# Altium project MotorDriver.PrjPcb
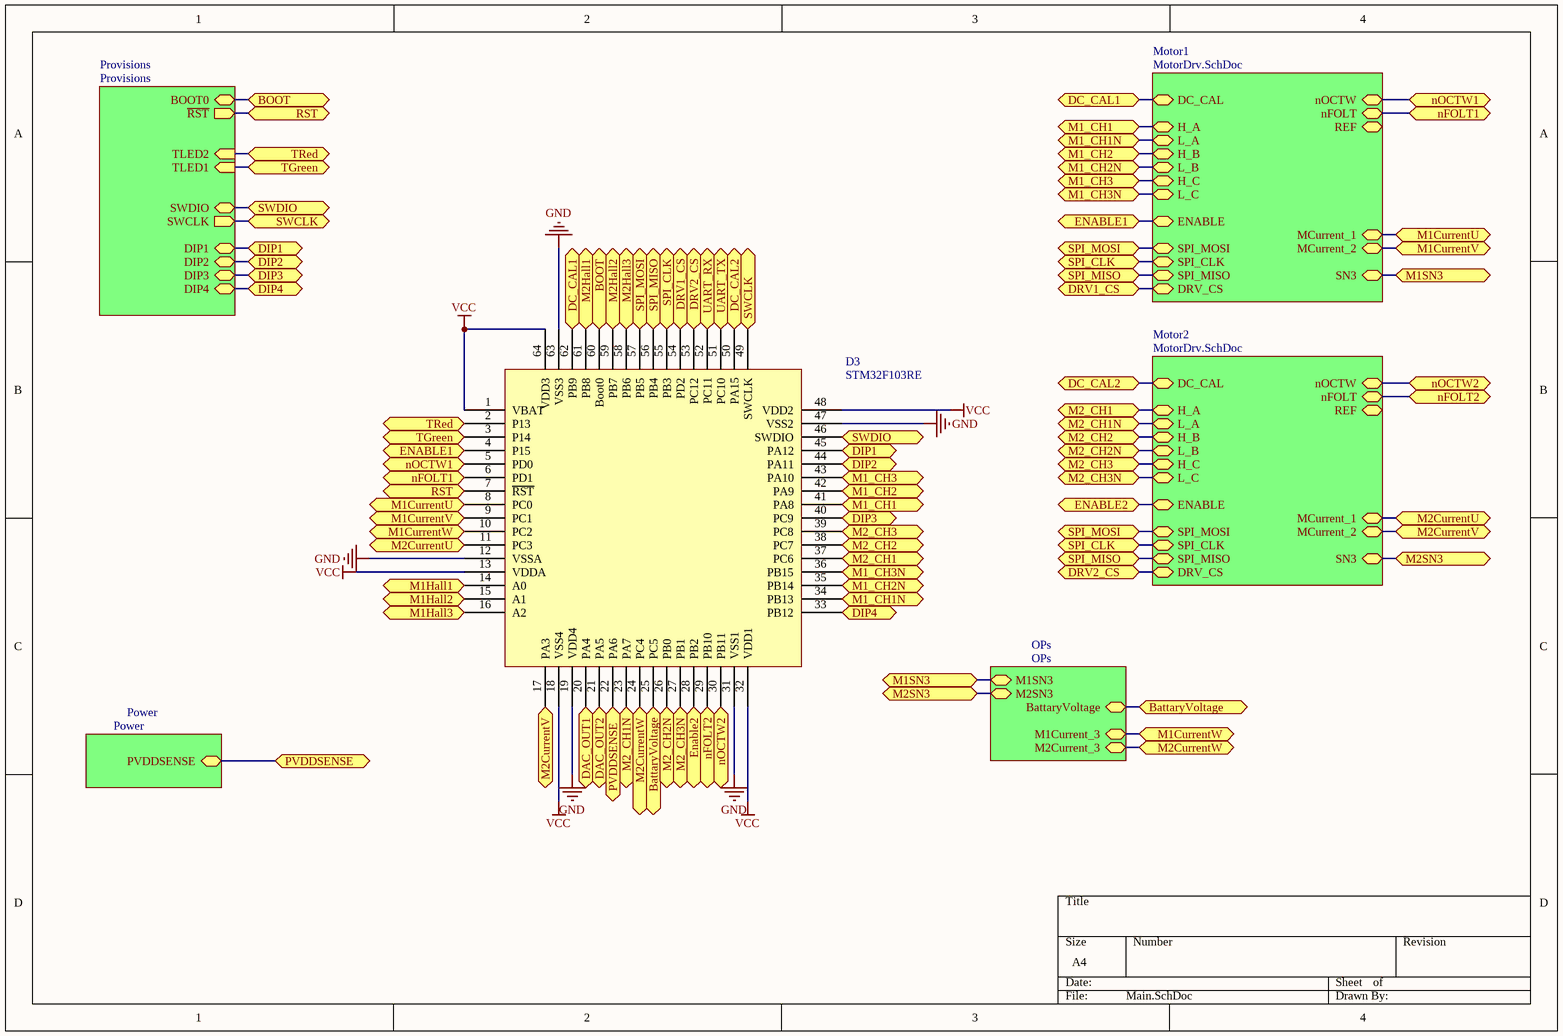
[diagram p0: Main.SchDoc]
8 sheets, 168 parts. Net scope: hierarchical (ports join the sheet entries above them; power ports are global).
Board file: Motor1.PcbDoc
Sheets:
  Main.SchDoc
    Motor1 = MotorDrv.SchDoc
      Driver = Drv8301.SchDoc
      MOSFETs = MOSFETs.SchDoc
        Channel_A = Bridge.SchDoc
        Channel_B = Bridge.SchDoc
        Channel_C = Bridge.SchDoc
    Power = Power.SchDoc
    Motor2 = MotorDrv.SchDoc
      Driver = Drv8301.SchDoc
      MOSFETs = MOSFETs.SchDoc
        Channel_A = Bridge.SchDoc
        Channel_B = Bridge.SchDoc
        Channel_C = Bridge.SchDoc
    OPs = OPs.SchDoc
    Provisions = Provisions.SchDoc

## Sheet Main.SchDoc
size A4

### Parts
D3  STM32F103RE  [LQFP64_N]

### Sub-sheets
Motor1 = MotorDrv.SchDoc: DRV_CS, H_A, H_C, DC_CAL, L_A, H_B, ENABLE, SPI_MOSI, SPI_CLK, nOCTW, REF, nFOLT, L_B, L_C, SPI_MISO, MCurrent_1, MCurrent_2, SN3
Motor2 = MotorDrv.SchDoc: DRV_CS, H_A, H_C, DC_CAL, L_A, H_B, ENABLE, SPI_MOSI, SPI_CLK, nOCTW, REF, nFOLT, L_B, L_C, SPI_MISO, MCurrent_1, MCurrent_2, SN3
OPs = OPs: BattaryVoltage, M2SN3, M2Current_3, M1SN3, M1Current_3
Power = Power: PVDDSENSE
Provisions = Provisions: BOOT0, SWCLK (out), TLED2 (in), TLED1 (in), SWDIO, ~{RST} (out), DIP3, DIP4, DIP2, DIP1

### Ports
BattaryVoltage, BOOT, DAC_OUT1, DAC_OUT2, DC_CAL1, DC_CAL2, DIP1, DIP2, DIP3, DIP4, DRV1_CS, DRV2_CS, ENABLE1, Enable2, ENABLE2, M1_CH1, M1_CH1N, M1_CH2, M1_CH2N, M1_CH3, M1_CH3N, M1CurrentU, M1CurrentV, M1CurrentW, M1Hall1, M1Hall2, M1Hall3, M1SN3, M2_CH1, M2_CH1N, M2_CH2, M2_CH2N, M2_CH3, M2_CH3N, M2CurrentU, M2CurrentV, M2CurrentW, M2Hall1, M2Hall2, M2Hall3, M2SN3, nFOLT1, nFOLT2, nOCTW1, nOCTW2, PVDDSENSE, RST, SPI_CLK, SPI_MISO, SPI_MOSI, SWCLK, SWDIO, TGreen, TRed, UART_RX, UART_TX

### Nets
GND: D3.12(VSSA) D3.19(VDD4) D3.31(VSS1) D3.47(VSS2) D3.63(VSS3)
VCC: D3.1(VBAT) D3.13(VDDA) D3.18(VSS4) D3.32(VDD1) D3.48(VDD2) D3.64(VDD3)
~{RST}: D3.7(~{RST}) ; port RST, sheet Provisions/~{RST}
SN3: port M1SN3, sheet Motor1/SN3, sheet OPs/M1SN3
SN3: port M2SN3, sheet Motor2/SN3, sheet OPs/M2SN3  [a separate net that carries the same name]
NetC18_Driver1_2: D3.9(PC1) ; port M1CurrentV, sheet Motor1/MCurrent_2
NetC18_Driver2_2: D3.17(PA3) ; port M2CurrentV, sheet Motor2/MCurrent_2
NetC19_Driver1_2: D3.8(PC0) ; port M1CurrentU, sheet Motor1/MCurrent_1
NetC19_Driver2_2: D3.11(PC3) ; port M2CurrentU, sheet Motor2/MCurrent_1
NetC27_2: D3.22(PA6) ; port PVDDSENSE, sheet Power/PVDDSENSE
NetD1_Driver1_5: D3.5(PD0) ; port nOCTW1, sheet Motor1/nOCTW
NetD1_Driver1_6: D3.6(PD1) ; port nFOLT1, sheet Motor1/nFOLT
NetD1_Driver1_8: D3.54(PD2) ; port DRV1_CS, sheet Motor1/DRV_CS
NetD1_Driver1_9: D3.57(PB5) ; port SPI_MOSI, sheet Motor1/SPI_MOSI, sheet Motor2/SPI_MOSI
NetD1_Driver1_10: D3.56(PB4) ; port SPI_MISO, sheet Motor1/SPI_MISO, sheet Motor2/SPI_MISO
NetD1_Driver1_11: D3.55(PB3) ; port SPI_CLK, sheet Motor1/SPI_CLK, sheet Motor2/SPI_CLK
NetD1_Driver1_12: D3.62(PB9) ; port DC_CAL1, sheet Motor1/DC_CAL
NetD1_Driver1_16: D3.4(P15) ; port ENABLE1, sheet Motor1/ENABLE
NetD1_Driver1_17: D3.41(PA8) ; port M1_CH1, sheet Motor1/H_A
NetD1_Driver1_18: D3.34(PB13) ; port M1_CH1N, sheet Motor1/L_A
NetD1_Driver1_19: D3.42(PA9) ; port M1_CH2, sheet Motor1/H_B
NetD1_Driver1_20: D3.35(PB14) ; port M1_CH2N, sheet Motor1/L_B
NetD1_Driver1_21: D3.43(PA10) ; port M1_CH3, sheet Motor1/H_C
NetD1_Driver1_22: D3.36(PB15) ; port M1_CH3N, sheet Motor1/L_C
NetD1_Driver2_5: D3.30(PB11) ; port nOCTW2, sheet Motor2/nOCTW
NetD1_Driver2_6: D3.29(PB10) ; port nFOLT2, sheet Motor2/nFOLT
NetD1_Driver2_8: D3.53(PC12) ; port DRV2_CS, sheet Motor2/DRV_CS
NetD1_Driver2_12: D3.50(PA15) ; port DC_CAL2, sheet Motor2/DC_CAL
NetD1_Driver2_16: D3.28(PB2) ; port Enable2, port ENABLE2, sheet Motor2/ENABLE
NetD1_Driver2_17: D3.37(PC6) ; port M2_CH1, sheet Motor2/H_A
NetD1_Driver2_18: D3.23(PA7) ; port M2_CH1N, sheet Motor2/L_A
NetD1_Driver2_19: D3.38(PC7) ; port M2_CH2, sheet Motor2/H_B
NetD1_Driver2_20: D3.26(PB0) ; port M2_CH2N, sheet Motor2/L_B
NetD1_Driver2_21: D3.39(PC8) ; port M2_CH3, sheet Motor2/H_C
NetD1_Driver2_22: D3.27(PB1) ; port M2_CH3N, sheet Motor2/L_C
NetD3_2: D3.2(P13) ; port TRed, sheet Provisions/TLED2
NetD3_3: D3.3(P14) ; port TGreen, sheet Provisions/TLED1
NetD3_10: D3.10(PC2) ; port M1CurrentW, sheet OPs/M1Current_3
NetD3_14: D3.14(A0) ; port M1Hall1
NetD3_15: D3.15(A1) ; port M1Hall2
NetD3_16: D3.16(A2) ; port M1Hall3
NetD3_20: D3.20(PA4) ; port DAC_OUT1
NetD3_21: D3.21(PA5) ; port DAC_OUT2
NetD3_24: D3.24(PC4) ; port M2CurrentW, sheet OPs/M2Current_3
NetD3_25: D3.25(PC5) ; port BattaryVoltage, sheet OPs/BattaryVoltage
NetD3_33: D3.33(PB12) ; port DIP4, sheet Provisions/DIP4
NetD3_40: D3.40(PC9) ; port DIP3, sheet Provisions/DIP3
NetD3_44: D3.44(PA11) ; port DIP2, sheet Provisions/DIP2
NetD3_45: D3.45(PA12) ; port DIP1, sheet Provisions/DIP1
NetD3_46: D3.46(SWDIO) ; port SWDIO, sheet Provisions/SWDIO
NetD3_49: D3.49(SWCLK) ; port SWCLK, sheet Provisions/SWCLK
NetD3_51: D3.51(PC10) ; port UART_TX
NetD3_52: D3.52(PC11) ; port UART_RX
NetD3_58: D3.58(PB6) ; port M2Hall3
NetD3_59: D3.59(PB7) ; port M2Hall2
NetD3_60: D3.60(Boot0) ; port BOOT, sheet Provisions/BOOT0
NetD3_61: D3.61(PB8) ; port M2Hall1

### Library data of the parts
D3 = STM32F103RE: High-density performance line ARM®-based 32-bit MCU with 256 to 512KB  Flash, USB, CAN, 11 timers, 3 ADCs, 13 communication interfaces

## Sheet MotorDrv.SchDoc
size A4
Used 2 times, as channels Motor1, Motor2. Parts and nets are listed once, with the designators drawn on the sheet.
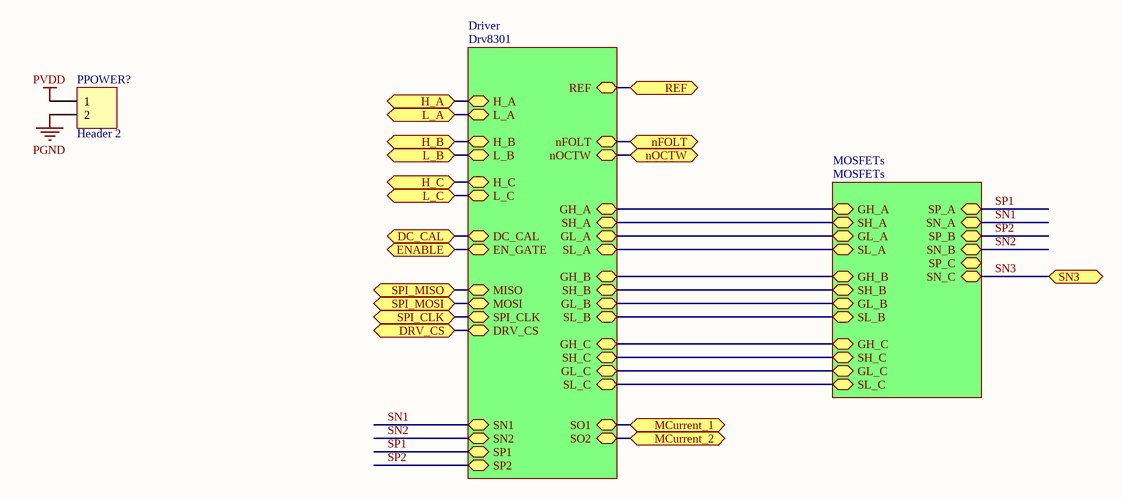
[diagram p1: MotorDrv.SchDoc]

### Parts
PPOWER?  Header 2  [WJ370-02-75]

### Sub-sheets
Driver = Drv8301: L_B, REF, SH_B, MISO, GH_B, nOCTW, H_A, EN_GATE, GL_C, GL_A, H_B, SO1, GH_C, SO2, nFOLT, GL_B, SH_A, DC_CAL, L_A, GH_A, SPI_CLK, SL_A, L_C, H_C, SL_C, SH_C, MOSI, SL_B, DRV_CS, SN1, SN2, SP2, SP1
MOSFETs = MOSFETs: SP_B, SP_C, SH_B, SL_B, SN_C, GL_B, SN_B, GH_B, SP_A, GL_A, SN_A, SL_A, GH_A, GL_C, SH_A, SL_C, SH_C, GH_C

### Ports
DC_CAL, DRV_CS, ENABLE, H_A, H_B, H_C, L_A, L_B, L_C, MCurrent_1, MCurrent_2, nFOLT, nOCTW, REF, SN3, SPI_CLK, SPI_MISO, SPI_MOSI

### Nets
PGND: PPOWER?.2
PVDD: PPOWER?.1
DC_CAL: port DC_CAL, sheet Driver/DC_CAL
DRV_CS: port DRV_CS, sheet Driver/DRV_CS
ENABLE: port ENABLE, sheet Driver/EN_GATE
H_A: port H_A, sheet Driver/H_A
H_B: port H_B, sheet Driver/H_B
H_C: port H_C, sheet Driver/H_C
L_A: port L_A, sheet Driver/L_A
L_B: port L_B, sheet Driver/L_B
L_C: port L_C, sheet Driver/L_C
MCurrent_1: port MCurrent_1, sheet Driver/SO1
MCurrent_2: port MCurrent_2, sheet Driver/SO2
nFOLT: port nFOLT, sheet Driver/nFOLT
nOCTW: port nOCTW, sheet Driver/nOCTW
REF: port REF, sheet Driver/REF
SN1: sheet Driver/SN1, sheet MOSFETs/SN_A
SN2: sheet Driver/SN2, sheet MOSFETs/SN_B
SN3: port SN3, sheet MOSFETs/SN_C
SP1: sheet Driver/SP1, sheet MOSFETs/SP_A
SP2: sheet Driver/SP2, sheet MOSFETs/SP_B
SPI_CLK: port SPI_CLK, sheet Driver/SPI_CLK
SPI_MISO: port SPI_MISO, sheet Driver/MISO
SPI_MOSI: port SPI_MOSI, sheet Driver/MOSI
(unnamed): sheet Driver/SH_B, sheet MOSFETs/SH_B
(unnamed): sheet Driver/GH_B, sheet MOSFETs/GH_B
(unnamed): sheet Driver/GL_C, sheet MOSFETs/GL_C
(unnamed): sheet Driver/GL_A, sheet MOSFETs/GL_A
(unnamed): sheet Driver/GH_C, sheet MOSFETs/GH_C
(unnamed): sheet Driver/GL_B, sheet MOSFETs/GL_B
(unnamed): sheet Driver/SH_A, sheet MOSFETs/SH_A
(unnamed): sheet Driver/GH_A, sheet MOSFETs/GH_A
(unnamed): sheet Driver/SL_A, sheet MOSFETs/SL_A
(unnamed): sheet Driver/SL_C, sheet MOSFETs/SL_C
(unnamed): sheet Driver/SH_C, sheet MOSFETs/SH_C
(unnamed): sheet Driver/SL_B, sheet MOSFETs/SL_B

### Channels
Motor1: designators end in _Motor1; ports DC_CAL=NetD1_Driver1_12 DRV_CS=NetD1_Driver1_8 ENABLE=NetD1_Driver1_16 H_A=NetD1_Driver1_17 H_B=NetD1_Driver1_19 H_C=NetD1_Driver1_21 L_A=NetD1_Driver1_18 L_B=NetD1_Driver1_20 L_C=NetD1_Driver1_22 MCurrent_1=NetC19_Driver1_2 MCurrent_2=NetC18_Driver1_2 nFOLT=NetD1_Driver1_6 nOCTW=NetD1_Driver1_5 REF=NetD1_Driver1_24 SN3=SN3 SPI_CLK=NetD1_Driver1_11 SPI_MISO=NetD1_Driver1_10 SPI_MOSI=NetD1_Driver1_9
Motor2: designators end in _Motor2; ports DC_CAL=NetD1_Driver2_12 DRV_CS=NetD1_Driver2_8 ENABLE=NetD1_Driver2_16 H_A=NetD1_Driver2_17 H_B=NetD1_Driver2_19 H_C=NetD1_Driver2_21 L_A=NetD1_Driver2_18 L_B=NetD1_Driver2_20 L_C=NetD1_Driver2_22 MCurrent_1=NetC19_Driver2_2 MCurrent_2=NetC18_Driver2_2 nFOLT=NetD1_Driver2_6 nOCTW=NetD1_Driver2_5 REF=NetD1_Driver2_24 SN3=SN3 SPI_CLK=NetD1_Driver1_11 SPI_MISO=NetD1_Driver1_10 SPI_MOSI=NetD1_Driver1_9

### Library data of the parts
PPOWER? = Header 2: Header, 2-Pin; LatestRevisionDate: 17-Jul-2002; LatestRevisionNote: Re-released for DXP Platform.; Publisher: Altium Limited

## Sheet Drv8301.SchDoc
size A4
Used 2 times, as channels Motor1/Driver, Motor2/Driver. Parts and nets are listed once, with the designators drawn on the sheet.
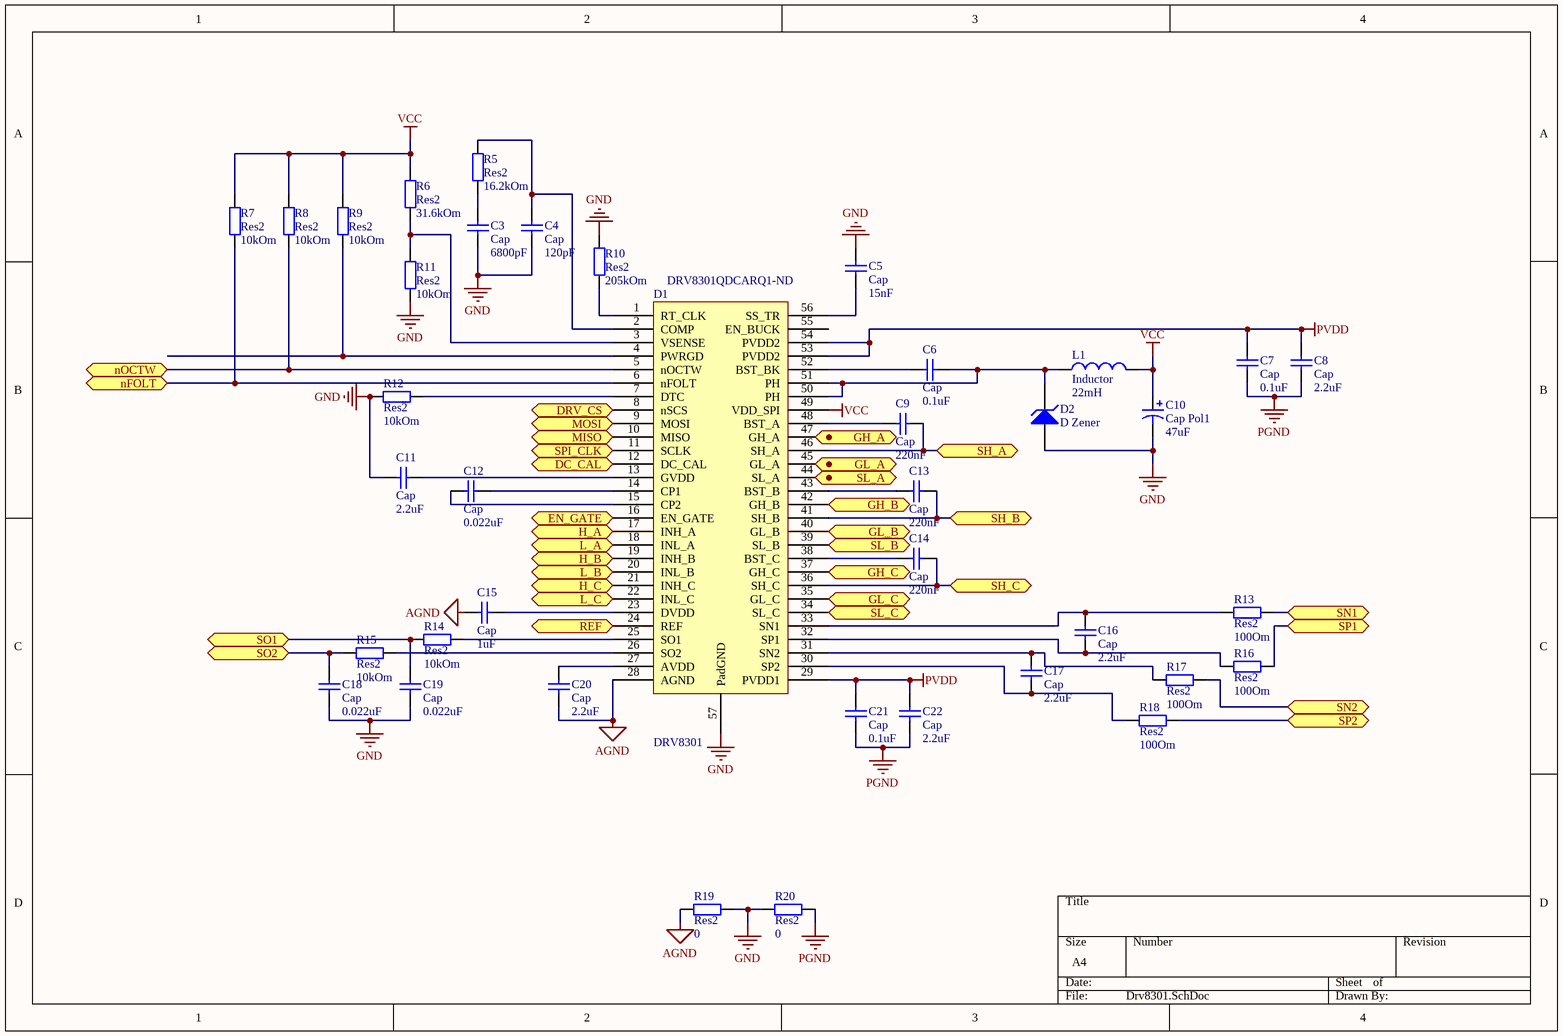
[diagram p2: Drv8301.SchDoc]

### Parts
C3  Cap  value 6800pF  [6-0805_N]
C4  Cap  value 120pF  [6-0805_N]
C5  Cap  value 15nF  [6-0805_N]
C6  Cap  value 0.1uF  [6-0805_N]
C7  Cap  value 0.1uF  [C1206]
C8  Cap  value 2.2uF  [C1206]
C9  Cap  value 220nF  [RAD-0.3]
C10  Cap Pol1  value 47uF  [C1210_N]
C11  Cap  value 2.2uF  [C1210_N]
C12  Cap  value 0.022uF  [6-0805_N]
C13  Cap  value 220nF  [RAD-0.3]
C14  Cap  value 220nF  [RAD-0.3]
C15  Cap  value 1uF  [6-0805_N]
C16  Cap  value 2.2uF  [6-0805_N]
C17  Cap  value 2.2uF  [6-0805_N]
C18  Cap  value 0.022uF  [6-0805_N]
C19  Cap  value 0.022uF  [6-0805_N]
C20  Cap  value 2.2uF  [6-0805_N]
C21  Cap  value 0.1uF  [C1206]
C22  Cap  value 2.2uF  [C1206]
D1  DRV8301  Supplier Part Number 1: DRV8301QDCARQ1-ND  [HTSSOP56]
D2  D Zener  [SMB]
L1  Inductor  value 22mH  [INDC4532]
R5  Res2  value 16.2kOm  [6-0805_N]
R6  Res2  value 31.6kOm  [6-0805_N]
R7  Res2  value 10kOm  [6-0805_N]
R8  Res2  value 10kOm  [6-0805_N]
R9  Res2  value 10kOm  [6-0805_N]
R10  Res2  value 205kOm  [6-0805_N]
R11  Res2  value 10kOm  [6-0805_N]
R12  Res2  value 10kOm  [6-0805_N]
R13  Res2  value 100Om  [6-0805_N]
R14  Res2  value 10kOm  [6-0805_N]
R15  Res2  value 10kOm  [6-0805_N]
R16  Res2  value 100Om  [6-0805_N]
R17  Res2  value 100Om  [6-0805_N]
R18  Res2  value 100Om  [6-0805_N]
R19  Res2  value 0  [6-0805_N]
R20  Res2  value 0  [6-0805_N]

### Ports
DC_CAL, DRV_CS, EN_GATE, GH_A, GH_B, GH_C, GL_A, GL_B, GL_C, H_A, H_B, H_C, L_A, L_B, L_C, MISO, MOSI, nFOLT, nOCTW, REF, SH_A, SH_B, SH_C, SL_A, SL_B, SL_C, SN1, SN2, SO1, SO2, SP1, SP2, SPI_CLK

### Nets
AGND: C15.1 C20.1 D1.28(AGND) R19.1
GND: C3.2 C4.2 C5.1 C10.2 C11.1 C18.1 C19.1 D1.57(PadGND) D2.1(A) R10.2 R11.1 R12.2 R19.2 R20.1
PGND: C7.1 C8.1 C21.1 C22.1 R20.2
PVDD: C7.2 C8.2 C21.2 C22.2 D1.29(PVDD1) D1.53(PVDD2) D1.54(PVDD2)
VCC: C10.1 D1.49(VDD_SPI) L1.2 R6.2 R7.2 R8.2 R9.2
DC_CAL: D1.12(DC_CAL) ; port DC_CAL
DRV_CS: D1.8(nSCS) ; port DRV_CS
EN_GATE: D1.16(EN_GATE) ; port EN_GATE
GH_B: D1.42(GH_B) ; port GH_B
GH_C: D1.37(GH_C) ; port GH_C
GL_B: D1.40(GL_B) ; port GL_B
GL_C: D1.35(GL_C) ; port GL_C
H_A: D1.17(INH_A) ; port H_A
H_B: D1.19(INH_B) ; port H_B
H_C: D1.21(INH_C) ; port H_C
L_A: D1.18(INL_A) ; port L_A
L_B: D1.20(INL_B) ; port L_B
L_C: D1.22(INL_C) ; port L_C
MISO: D1.10(MISO) ; port MISO
MOSI: D1.9(MOSI) ; port MOSI
nFOLT: D1.6(nFOLT) R7.1 ; port nFOLT
nOCTW: D1.5(nOCTW) R8.1 ; port nOCTW
REF: D1.24(REF) ; port REF
SH_A: C9.1 D1.46(SH_A) ; port SH_A
SH_B: C13.1 D1.41(SH_B) ; port SH_B
SH_C: C14.1 D1.36(SH_C) ; port SH_C
SL_B: D1.39(SL_B) ; port SL_B
SL_C: D1.34(SL_C) ; port SL_C
SN1: R13.1 ; port SN1
SN2: R17.1 ; port SN2
SO1: C19.2 R14.2 ; port SO1
SO2: C18.2 R15.2 ; port SO2
SP1: R16.1 ; port SP1
SP2: R18.1 ; port SP2
SPI_CLK: D1.11(SCLK) ; port SPI_CLK
NetC3_1: C3.1 R5.1
NetC4_1: C4.1 D1.2(COMP) R5.2
NetC5_2: C5.2 D1.56(SS_TR)
NetC6_1: C6.1 D1.50(PH) D1.51(PH) D2.2(K) L1.1
NetC6_2: C6.2 D1.52(BST_BK)
NetC9_2: C9.2 D1.48(BST_A)
NetC11_2: C11.2 D1.13(GVDD)
NetC12_1: C12.1 D1.15(CP2)
NetC12_2: C12.2 D1.14(CP1)
NetC13_2: C13.2 D1.43(BST_B)
NetC14_2: C14.2 D1.38(BST_C)
NetC15_2: C15.2 D1.23(DVDD)
NetC16_1: C16.1 D1.32(SP1) R16.2
NetC16_2: C16.2 D1.33(SN1) R13.2
NetC17_1: C17.1 D1.30(SP2) R18.2
NetC17_2: C17.2 D1.31(SN2) R17.2
NetC20_2: C20.2 D1.27(AVDD)
NetD1_1: D1.1(RT_CLK) R10.1
NetD1_3: D1.3(VSENSE) R6.1 R11.2
NetD1_4: D1.4(PWRGD) R9.1
NetD1_7: D1.7(DTC) R12.1
NetD1_25: D1.25(SO1) R14.1
NetD1_26: D1.26(SO2) R15.1

Not connected (* = marked no-connect by the designer): D1 44(SL_A) 45(GL_A) 47(GH_A) 55(EN_BUCK)

### Channels
Motor1/Driver: designators end in _Driver1; ports DC_CAL=NetD1_Driver1_12 DRV_CS=NetD1_Driver1_8 EN_GATE=NetD1_Driver1_16 GH_A=NetR1_Channel_A1_1 GH_B=NetD1_Driver1_42 GH_C=NetD1_Driver1_37 GL_A=NetR2_Channel_A1_1 GL_B=NetD1_Driver1_40 GL_C=NetD1_Driver1_35 H_A=NetD1_Driver1_17 H_B=NetD1_Driver1_19 H_C=NetD1_Driver1_21 L_A=NetD1_Driver1_18 L_B=NetD1_Driver1_20 L_C=NetD1_Driver1_22 MISO=NetD1_Driver1_10 MOSI=NetD1_Driver1_9 nFOLT=NetD1_Driver1_6 nOCTW=NetD1_Driver1_5 REF=NetD1_Driver1_24 SH_A=NetC9_Driver1_1 SH_B=NetC13_Driver1_1 SH_C=NetC14_Driver1_1 SL_A=SN1_Motor1 SL_B=SN2_Motor1 SL_C=SN3 SN1=SN1_Motor1 SN2=SN2_Motor1 SO1=NetC19_Driver1_2 SO2=NetC18_Driver1_2 SP1=SP1 SP2=SP1 SPI_CLK=NetD1_Driver1_11
Motor2/Driver: designators end in _Driver2; ports DC_CAL=NetD1_Driver2_12 DRV_CS=NetD1_Driver2_8 EN_GATE=NetD1_Driver2_16 GH_A=NetR1_Channel_A2_1 GH_B=NetD1_Driver2_42 GH_C=NetD1_Driver2_37 GL_A=NetR2_Channel_A2_1 GL_B=NetD1_Driver2_40 GL_C=NetD1_Driver2_35 H_A=NetD1_Driver2_17 H_B=NetD1_Driver2_19 H_C=NetD1_Driver2_21 L_A=NetD1_Driver2_18 L_B=NetD1_Driver2_20 L_C=NetD1_Driver2_22 MISO=NetD1_Driver1_10 MOSI=NetD1_Driver1_9 nFOLT=NetD1_Driver2_6 nOCTW=NetD1_Driver2_5 REF=NetD1_Driver2_24 SH_A=NetC9_Driver2_1 SH_B=NetC13_Driver2_1 SH_C=NetC14_Driver2_1 SL_A=SN1_Motor2 SL_B=SN2_Motor2 SL_C=SN3 SN1=SN1_Motor2 SN2=SN2_Motor2 SO1=NetC19_Driver2_2 SO2=NetC18_Driver2_2 SP1=SP1 SP2=SP1 SPI_CLK=NetD1_Driver1_11

### Library data of the parts
C3-C9 C11-C21 = Cap: Capacitor; Published: 8-Jun-2000; LatestRevisionDate: 17-Jul-2002; LatestRevisionNote: Re-released for DXP Platform.; PackageReference: RAD-0.3; Publisher: Altium Limited; PackageDescription: Radial Cap, Thru-Hole; 2 Leads; 0.3 in Pin Spacing
  C12 C21: REF: http://kosmodrom.com.ua/el.php?name=CAP-CERAMIC-Y2-0.01-250
C10 = Cap Pol1: Polarized Capacitor (Radial); Published: 8-Jun-2000; LatestRevisionDate: 17-Jul-2002; LatestRevisionNote: Re-released for DXP Platform.; PackageReference: RB7.6-15; Publisher: Altium Limited; PackageDescription: Polarized Capacitor (Radial); 2 Leads
C22 = Cap: ECAP-NOPOLAR-4,7mkf; Published: 8-Jun-2000; LatestRevisionDate: 17-Jul-2002; LatestRevisionNote: Re-released for DXP Platform.; PackageReference: RAD-0.3; Publisher: Altium Limited; PackageDescription: Radial Cap, Thru-Hole; 2 Leads; 0.3 in Pin Spacing; REF: http://kosmodrom.com.ua/el.php?name=ECAP4.7MKF100VNP5X11
D1 = DRV8301: DRV8301 Three-Phase Gate Driver With Dual Current Shunt Amplifiers  and Buck Regulator; Supplier 1: Digi-Key
D2 = D Zener: Zener Diode; Published: 8-Jun-2000; LatestRevisionDate: 17-Jul-2002; LatestRevisionNote: Re-released for DXP Platform.; PackageReference: DIODE-0.7; Publisher: Altium Limited; PackageDescription: Diode, Thru-Hole; 2 Leads; 0.7 in Pin Spacing
L1 = Inductor: Code_IEC: 1005; Published: 8-Jun-2000; LatestRevisionDate: 29-May-2009; LatestRevisionNote: IPC-7351 Footprint Added.; PackageReference: 0402-A; Publisher: Altium Limited; PackageDescription: Chip Inductor; Code_JEITA: 0402
R5-R20 = Res2: Resistor; Published: 8-Jun-2000; LatestRevisionDate: 17-Jul-2002; LatestRevisionNote: Re-released for DXP Platform.; PackageReference: AXIAL-0.4; Publisher: Altium Limited; PackageDescription: Axial Device, Thru-Hole; 2 Leads; 0.4 in Pin Spacing

## Sheet MOSFETs.SchDoc
size A4
Used 2 times, as channels Motor1/MOSFETs, Motor2/MOSFETs. Parts and nets are listed once, with the designators drawn on the sheet.
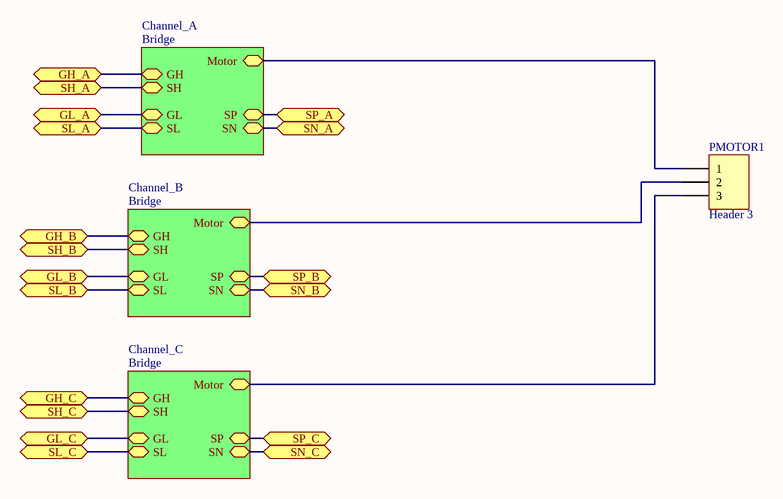
[diagram p3: MOSFETs.SchDoc]

### Parts
PMOTOR1  Header 3  [HDR1X3]

### Sub-sheets
Channel_A = Bridge: GH, SH, SL, Motor, SN, SP, GL
Channel_B = Bridge: GH, SH, SL, Motor, SN, SP, GL
Channel_C = Bridge: GH, SH, SL, Motor, SN, SP, GL

### Ports
GH_A, GH_B, GH_C, GL_A, GL_B, GL_C, SH_A, SH_B, SH_C, SL_A, SL_B, SL_C, SN_A, SN_B, SN_C, SP_A, SP_B, SP_C

### Nets
GH_A: port GH_A, sheet Channel_A/GH
GH_B: port GH_B, sheet Channel_B/GH
GH_C: port GH_C, sheet Channel_C/GH
GL_A: port GL_A, sheet Channel_A/GL
GL_B: port GL_B, sheet Channel_B/GL
GL_C: port GL_C, sheet Channel_C/GL
SH_A: port SH_A, sheet Channel_A/SH
SH_B: port SH_B, sheet Channel_B/SH
SH_C: port SH_C, sheet Channel_C/SH
SL_A: port SL_A, sheet Channel_A/SL
SL_B: port SL_B, sheet Channel_B/SL
SL_C: port SL_C, sheet Channel_C/SL
SN_A: port SN_A, sheet Channel_A/SN
SN_B: port SN_B, sheet Channel_B/SN
SN_C: port SN_C, sheet Channel_C/SN
SP_A: port SP_A, sheet Channel_A/SP
SP_B: port SP_B, sheet Channel_B/SP
SP_C: port SP_C, sheet Channel_C/SP
NetPMOTOR1_1: PMOTOR1.1 ; sheet Channel_A/Motor
NetPMOTOR1_2: PMOTOR1.2 ; sheet Channel_B/Motor
NetPMOTOR1_3: PMOTOR1.3 ; sheet Channel_C/Motor

### Channels
Motor1/MOSFETs: designators end in _MOSFETs1; ports GH_A=NetR1_Channel_A1_1 GH_B=NetD1_Driver1_42 GH_C=NetD1_Driver1_37 GL_A=NetR2_Channel_A1_1 GL_B=NetD1_Driver1_40 GL_C=NetD1_Driver1_35 SH_A=NetC9_Driver1_1 SH_B=NetC13_Driver1_1 SH_C=NetC14_Driver1_1 SL_A=SN1_Motor1 SL_B=SN2_Motor1 SL_C=SN3 SN_A=SN1_Motor1 SN_B=SN2_Motor1 SN_C=SN3 SP_A=SP1 SP_B=SP1 SP_C=SP1
Motor2/MOSFETs: designators end in _MOSFETs2; ports GH_A=NetR1_Channel_A2_1 GH_B=NetD1_Driver2_42 GH_C=NetD1_Driver2_37 GL_A=NetR2_Channel_A2_1 GL_B=NetD1_Driver2_40 GL_C=NetD1_Driver2_35 SH_A=NetC9_Driver2_1 SH_B=NetC13_Driver2_1 SH_C=NetC14_Driver2_1 SL_A=SN1_Motor2 SL_B=SN2_Motor2 SL_C=SN3 SN_A=SN1_Motor2 SN_B=SN2_Motor2 SN_C=SN3 SP_A=SP1 SP_B=SP1 SP_C=SP1

### Library data of the parts
PMOTOR1 = Header 3: Header, 3-Pin; LatestRevisionDate: 17-Jul-2002; LatestRevisionNote: Re-released for DXP Platform.; Publisher: Altium Limited

## Sheet Bridge.SchDoc
size A4
Used 6 times, as channels Motor1/MOSFETs/Channel_A, Motor1/MOSFETs/Channel_B, Motor1/MOSFETs/Channel_C, Motor2/MOSFETs/Channel_A, Motor2/MOSFETs/Channel_B, Motor2/MOSFETs/Channel_C. Parts and nets are listed once, with the designators drawn on the sheet.
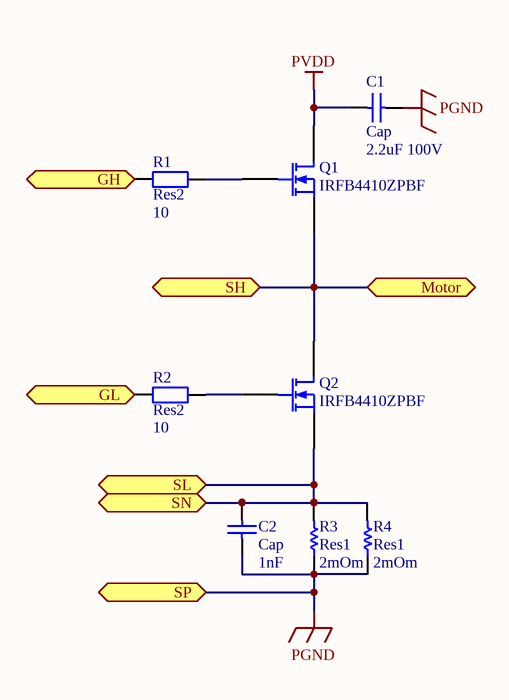
[diagram p4: Bridge.SchDoc]

### Parts
C1  Cap  value 2.2uF 100V  [RAD-0.3]
C2  Cap  value 1nF  [RAD-0.3]
Q1  IRFB4410ZPBF  [TO-220AB]
Q2  IRFB4410ZPBF  [TO-220AB]
R1  Res2  value 10  [6-0805_N]
R2  Res2  value 10  [6-0805_N]
R3  Res1  value 2mOm  [AXIAL-0.3]
R4  Res1  value 2mOm  [AXIAL-0.3]

### Ports
GH, GL, Motor, SH, SL, SN, SP

### Nets
PGND: C1.1 C2.1 R3.1 R4.1 ; port SP
PVDD: C1.2 Q1.1(D)
GH: R1.1 ; port GH
GL: R2.1 ; port GL
Motor: Q1.3(S) Q2.1(D) ; port SH, port Motor
SL: C2.2 Q2.3(S) R3.2 R4.2 ; port SL, port SN
NetQ1_2: Q1.2(G) R1.2
NetQ2_2: Q2.2(G) R2.2

### Channels
Motor1/MOSFETs/Channel_A: designators end in _Channel_A1; ports GH=NetR1_Channel_A1_1 GL=NetR2_Channel_A1_1 Motor=NetC9_Driver1_1 SH=NetC9_Driver1_1 SL=SN1_Motor1 SN=SN1_Motor1 SP=SP1
Motor1/MOSFETs/Channel_B: designators end in _Channel_B1; ports GH=NetD1_Driver1_42 GL=NetD1_Driver1_40 Motor=NetC13_Driver1_1 SH=NetC13_Driver1_1 SL=SN2_Motor1 SN=SN2_Motor1 SP=SP1
Motor1/MOSFETs/Channel_C: designators end in _Channel_C1; ports GH=NetD1_Driver1_37 GL=NetD1_Driver1_35 Motor=NetC14_Driver1_1 SH=NetC14_Driver1_1 SL=SN3 SN=SN3 SP=SP1
Motor2/MOSFETs/Channel_A: designators end in _Channel_A2; ports GH=NetR1_Channel_A2_1 GL=NetR2_Channel_A2_1 Motor=NetC9_Driver2_1 SH=NetC9_Driver2_1 SL=SN1_Motor2 SN=SN1_Motor2 SP=SP1
Motor2/MOSFETs/Channel_B: designators end in _Channel_B2; ports GH=NetD1_Driver2_42 GL=NetD1_Driver2_40 Motor=NetC13_Driver2_1 SH=NetC13_Driver2_1 SL=SN2_Motor2 SN=SN2_Motor2 SP=SP1
Motor2/MOSFETs/Channel_C: designators end in _Channel_C2; ports GH=NetD1_Driver2_37 GL=NetD1_Driver2_35 Motor=NetC14_Driver2_1 SH=NetC14_Driver2_1 SL=SN3 SN=SN3 SP=SP1

### Library data of the parts
C1 C2 = Cap: Capacitor; Published: 8-Jun-2000; LatestRevisionDate: 17-Jul-2002; LatestRevisionNote: Re-released for DXP Platform.; PackageReference: RAD-0.3; Publisher: Altium Limited; PackageDescription: Radial Cap, Thru-Hole; 2 Leads; 0.3 in Pin Spacing
Q1 Q2 = MOSFET-N: Published: 8-Jun-2000; LatestRevisionDate: 17-Jul-2002; LatestRevisionNote: Re-released for DXP Platform.; PackageVersion: 1995/1996; PackageReference: E3; Publisher: Altium Limited; PackageDescription: TO, Flat Index; 3 In-Line, Axial Leads; Body Dia. 4.6mm; Lead Dia. 0.5 mm (max)
R1 R2 = Res2: Resistor; Published: 8-Jun-2000; LatestRevisionDate: 17-Jul-2002; LatestRevisionNote: Re-released for DXP Platform.; PackageReference: AXIAL-0.4; Publisher: Altium Limited; PackageDescription: Axial Device, Thru-Hole; 2 Leads; 0.4 in Pin Spacing
R3 R4 = Res1: Resistor; Published: 8-Jun-2000; LatestRevisionDate: 17-Jul-2002; LatestRevisionNote: Re-released for DXP Platform.; PackageReference: AXIAL-0.3; Publisher: Altium Limited; PackageDescription: Axial Device, Thru-Hole; 2 Leads; 0.3 in Pin Spacing

## Sheet Power.SchDoc
size A4
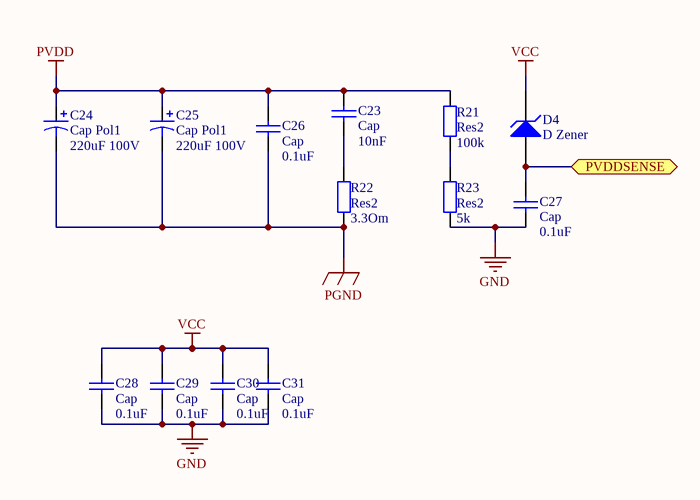
[diagram p5: Power.SchDoc]

### Parts
C23  Cap  value 10nF  [6-0805_N]
C24  Cap Pol1  value 220uF 100V  [RB7.6-15]
C25  Cap Pol1  value 220uF 100V  [RB7.6-15]
C26  Cap  value 0.1uF  [6-0805_N]
C27  Cap  value 0.1uF  [6-0805_N]
C28  Cap  value 0.1uF  [6-0805_N]
C29  Cap  value 0.1uF  [6-0805_N]
C30  Cap  value 0.1uF  [6-0805_N]
C31  Cap  value 0.1uF  [6-0805_N]
D4  D Zener  [SMB]
R21  Res2  value 100k  [6-0805_N]
R22  Res2  value 3.3Om  [6-0805_N]
R23  Res2  value 5k  [6-0805_N]

### Ports
PVDDSENSE

### Nets
GND: C27.1 C28.1 C29.1 C30.1 C31.1 R23.2
PGND: C24.2 C25.2 C26.1 R22.2  [project net SP1]
PVDD: C23.2 C24.1 C25.1 C26.2 R21.1
VCC: C28.2 C29.2 C30.2 C31.2 D4.2(K)
NetC23_1: C23.1 R22.1
NetC27_2: C27.2 D4.1(A) ; port PVDDSENSE
NetR21_2: R21.2 R23.1

### Library data of the parts
C23 C26-C31 = Cap: Capacitor; Published: 8-Jun-2000; LatestRevisionDate: 17-Jul-2002; LatestRevisionNote: Re-released for DXP Platform.; PackageReference: RAD-0.3; Publisher: Altium Limited; PackageDescription: Radial Cap, Thru-Hole; 2 Leads; 0.3 in Pin Spacing
C24 C25 = Cap Pol1: Polarized Capacitor (Radial); Published: 8-Jun-2000; LatestRevisionDate: 17-Jul-2002; LatestRevisionNote: Re-released for DXP Platform.; PackageReference: RB7.6-15; Publisher: Altium Limited; PackageDescription: Polarized Capacitor (Radial); 2 Leads
D4 = D Zener: Zener Diode; Published: 8-Jun-2000; LatestRevisionDate: 17-Jul-2002; LatestRevisionNote: Re-released for DXP Platform.; PackageReference: DIODE-0.7; Publisher: Altium Limited; PackageDescription: Diode, Thru-Hole; 2 Leads; 0.7 in Pin Spacing
R21-R23 = Res2: Resistor; Published: 8-Jun-2000; LatestRevisionDate: 17-Jul-2002; LatestRevisionNote: Re-released for DXP Platform.; PackageReference: AXIAL-0.4; Publisher: Altium Limited; PackageDescription: Axial Device, Thru-Hole; 2 Leads; 0.4 in Pin Spacing

## Sheet OPs.SchDoc
size A4
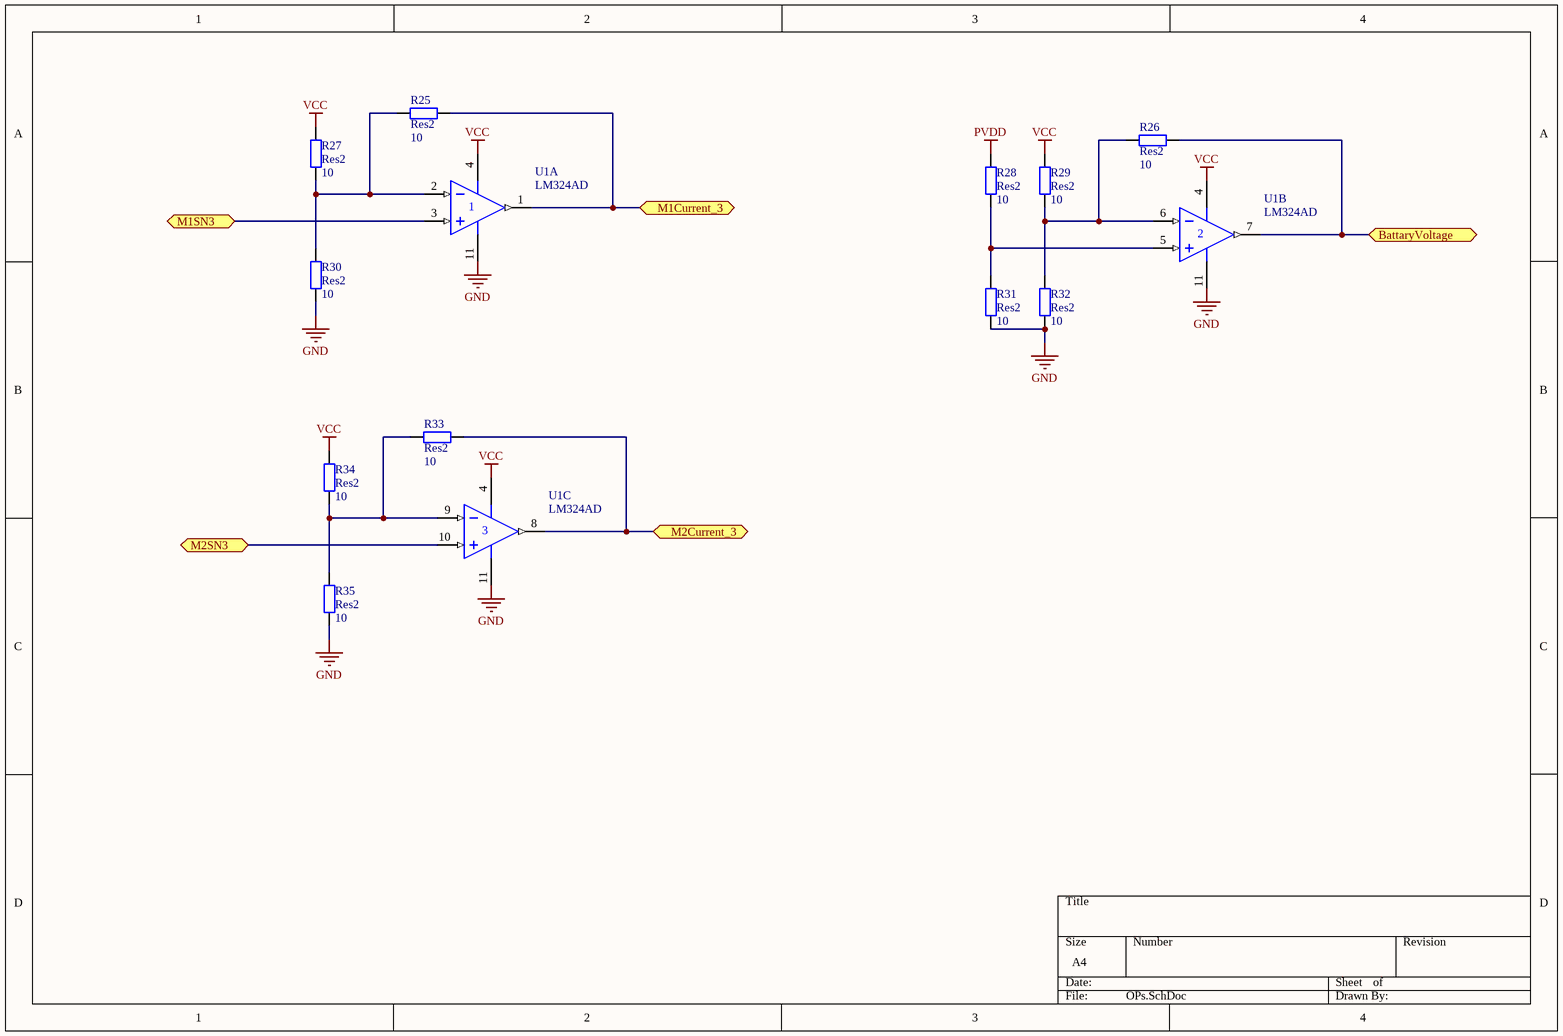
[diagram p6: OPs.SchDoc]

### Parts
R25  Res2  value 10  [6-0805_N]
R26  Res2  value 10  [6-0805_N]
R27  Res2  value 10  [6-0805_N]
R28  Res2  value 10  [6-0805_N]
R29  Res2  value 10  [6-0805_N]
R30  Res2  value 10  [6-0805_N]
R31  Res2  value 10  [6-0805_N]
R32  Res2  value 10  [6-0805_N]
R33  Res2  value 10  [6-0805_N]
R34  Res2  value 10  [6-0805_N]
R35  Res2  value 10  [6-0805_N]
U1  LM324AD  [751A-02_N]  (parts A,B,C of 4)

### Ports
BattaryVoltage, M1Current_3, M1SN3, M2Current_3, M2SN3

### Nets
GND: R30.1 R31.1 R32.1 R35.1 U1.11(V-)
PVDD: R28.2
VCC: R27.2 R29.2 R34.2 U1.4(V+)
SN3: U1.3(IN+) ; port M1SN3
SN3: U1.10(IN+) ; port M2SN3  [a separate net that carries the same name]
NetD3_10: R25.2 U1.1(OUT) ; port M1Current_3
NetD3_24: R33.2 U1.8(OUT) ; port M2Current_3
NetD3_25: R26.2 U1.7(OUT) ; port BattaryVoltage
NetR25_1: R25.1 R27.1 R30.2 U1.2(IN-)
NetR26_1: R26.1 R29.1 R32.2 U1.6(IN-)
NetR28_1: R28.1 R31.2 U1.5(IN+)
NetR33_1: R33.1 R34.1 R35.2 U1.9(IN-)

### Library data of the parts
R25-R35 = Res2: Resistor; Published: 8-Jun-2000; LatestRevisionDate: 17-Jul-2002; LatestRevisionNote: Re-released for DXP Platform.; PackageReference: AXIAL-0.4; Publisher: Altium Limited; PackageDescription: Axial Device, Thru-Hole; 2 Leads; 0.4 in Pin Spacing
U1 = LM324AD: Quad Low-Power Operational Amplifier; Published: 17-Jul-2002; LatestRevisionDate: 13-Apr-2006; LatestRevisionNote: IPC-7351 Footprint Added.; DatasheetVersion: 1988; PackageVersion: 1991; PackageReference: 751A-02; Publisher: Altium Limited; PackageDescription: 14-Pin Small Outline Integrated Circuit 1.27 mm Pitch; Code_IPC: SOIC127P600-14; ComponentLink1Description: Manufacturer Link; ComponentLink1URL: http://www.onsemi.com/site/products/parametrics/0,4446,251,00.html; ComponentLink2Description: Datasheet; ComponentLink2URL: http://www.onsemi.com/pub/Collateral/LM324-D.PDF

## Sheet Provisions.SchDoc
size A4
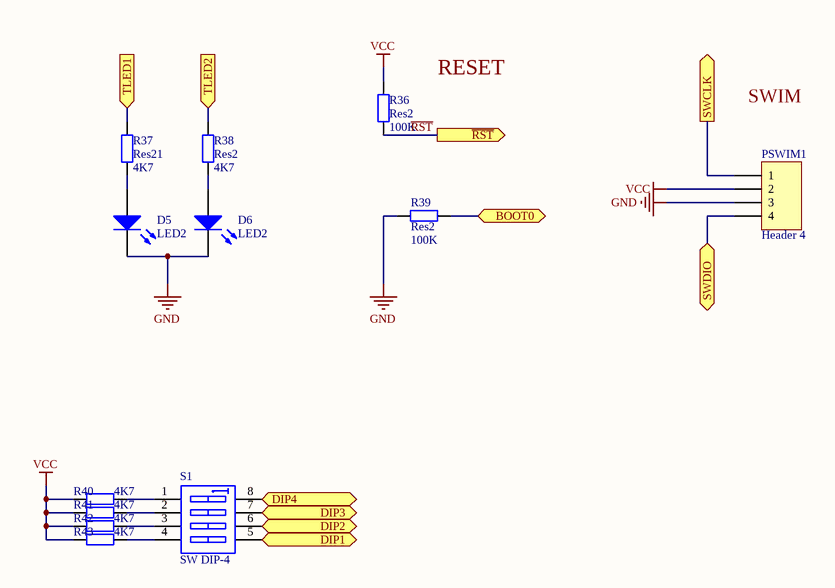
[diagram p7: Provisions.SchDoc]

### Parts
D5  LED2  [3.2X1.6X1.1]
D6  LED2  [3.2X1.6X1.1]
PSWIM1  Header 4  [HDR1X4]
R36  Res2  value 100K  [6-0805_N]
R37  Res21  value 4K7  [6-0805_N]
R38  Res2  value 4K7  [6-0805_N]
R39  Res2  value 100K  [6-0805_N]
R40  value 4K7  [6-0805_N]  (hidden comment: Res2)
R41  value 4K7  [6-0805_N]  (hidden comment: Res2)
R42  value 4K7  [6-0805_N]  (hidden comment: Res2)
R43  value 4K7  [6-0805_N]  (hidden comment: Res2)
S1  SW DIP-4  [SO8_N]

### Ports
BOOT0, DIP1, DIP2, DIP3, DIP4, SWCLK (out), SWDIO, TLED1 (in), TLED2 (in), ~{RST} (out)

### Nets
GND: D5.2(K) D6.2(K) PSWIM1.3 R39.2
VCC: PSWIM1.2 R36.2 R40.2 R41.2 R42.2 R43.2
~{RST}: R36.1 ; port ~{RST}
NetD3_2: R38.2 ; port TLED2
NetD3_3: R37.2 ; port TLED1
NetD3_33: S1.8(B1) ; port DIP4
NetD3_40: S1.7(B2) ; port DIP3
NetD3_44: S1.6(B3) ; port DIP2
NetD3_45: S1.5(B4) ; port DIP1
NetD3_46: PSWIM1.4 ; port SWDIO
NetD3_49: PSWIM1.1 ; port SWCLK
NetD3_60: R39.1 ; port BOOT0
NetD5_1: D5.1(A) R37.1
NetD6_1: D6.1(A) R38.1
NetR40_1: R40.1 S1.1(A1)
NetR41_1: R41.1 S1.2(A2)
NetR42_1: R42.1 S1.3(A3)
NetR43_1: R43.1 S1.4(A4)

### Notes on the sheet
- RESET
- SWIM

### Library data of the parts
D5 D6 = LED2: Typical RED, GREEN, YELLOW, AMBER GaAs LED; Published: 8-Jun-2000; LatestRevisionDate: 17-Jul-2002; LatestRevisionNote: Re-released for DXP Platform.; PackageVersion: Feb-2002; PackageReference: 3.2X1.6X1.1; Publisher: Altium Limited; PackageDescription: SM LED; 2 Flat Leads
  D6: Link: http://voron.ua/catalog/019503; Price: 1.29
PSWIM1 = Header 4: Header, 4-Pin; LatestRevisionDate: 17-Jul-2002; LatestRevisionNote: Re-released for DXP Platform.; Publisher: Altium Limited
R36-R43 = Res2: Resistor; Published: 8-Jun-2000; LatestRevisionDate: 17-Jul-2002; LatestRevisionNote: Re-released for DXP Platform.; PackageReference: AXIAL-0.4; Publisher: Altium Limited; PackageDescription: Axial Device, Thru-Hole; 2 Leads; 0.4 in Pin Spacing
S1 = SW DIP-4: DIP Switch, 4 Position, SPST; Published: 24-Mar-1999; LatestRevisionDate: 29-May-2009; LatestRevisionNote: IPC-7351 Footprint Added.; PackageVersion: Dec-2002; PackageReference: SO8; Publisher: Altium Limited; PackageDescription: 8-Pin Small Outline Integrated Circuit 1.27 mm Pitch; Code_JEDEC: MS-012-AA; Code_IPC: SOIC127P600-8

## Nets that join several sheets
AGND: Motor1/Driver (C15_Driver1.1 C20_Driver1.1 D1_Driver1.28 R19_Driver1.1), Motor2/Driver (C15_Driver2.1 C20_Driver2.1 D1_Driver2.28 R19_Driver2.1)
GND: Main (5 pins), Motor1/Driver (14 pins), Power (6 pins), Motor2/Driver (14 pins), OPs (5 pins), Provisions (D5.2 D6.2 PSWIM1.3 R39.2)
PVDD: Motor1 (PPOWER?_Motor1.1), Motor1/Driver (7 pins), Motor1/MOSFETs/Channel_A (C1_Channel_A1.2 Q1_Channel_A1.1), Motor1/MOSFETs/Channel_B (C1_Channel_B1.2 Q1_Channel_B1.1), Motor1/MOSFETs/Channel_C (C1_Channel_C1.2 Q1_Channel_C1.1), Power (5 pins), Motor2 (PPOWER?_Motor2.1), Motor2/Driver (7 pins), Motor2/MOSFETs/Channel_A (C1_Channel_A2.2 Q1_Channel_A2.1), Motor2/MOSFETs/Channel_B (C1_Channel_B2.2 Q1_Channel_B2.1), Motor2/MOSFETs/Channel_C (C1_Channel_C2.2 Q1_Channel_C2.1), OPs (R28.2)
SP1: Motor1 (PPOWER?_Motor1.2), Motor1/Driver (7 pins), Motor1/MOSFETs/Channel_A (C1_Channel_A1.1 C2_Channel_A1.1 R3_Channel_A1.1 R4_Channel_A1.1), Motor1/MOSFETs/Channel_B (C1_Channel_B1.1 C2_Channel_B1.1 R3_Channel_B1.1 R4_Channel_B1.1), Motor1/MOSFETs/Channel_C (C1_Channel_C1.1 C2_Channel_C1.1 R3_Channel_C1.1 R4_Channel_C1.1), Power (C24.2 C25.2 C26.1 R22.2), Motor2 (PPOWER?_Motor2.2), Motor2/Driver (7 pins), Motor2/MOSFETs/Channel_A (C1_Channel_A2.1 C2_Channel_A2.1 R3_Channel_A2.1 R4_Channel_A2.1), Motor2/MOSFETs/Channel_B (C1_Channel_B2.1 C2_Channel_B2.1 R3_Channel_B2.1 R4_Channel_B2.1), Motor2/MOSFETs/Channel_C (C1_Channel_C2.1 C2_Channel_C2.1 R3_Channel_C2.1 R4_Channel_C2.1)
VCC: Main (6 pins), Motor1/Driver (7 pins), Power (5 pins), Motor2/Driver (7 pins), OPs (R27.2 R29.2 R34.2 U1.4), Provisions (6 pins)
NetC9_Driver1_1: Motor1/Driver (C9_Driver1.1 D1_Driver1.46), Motor1/MOSFETs (PMOTOR1_MOSFETs1.1), Motor1/MOSFETs/Channel_A (Q1_Channel_A1.3 Q2_Channel_A1.1)
NetC9_Driver2_1: Motor2/Driver (C9_Driver2.1 D1_Driver2.46), Motor2/MOSFETs (PMOTOR1_MOSFETs2.1), Motor2/MOSFETs/Channel_A (Q1_Channel_A2.3 Q2_Channel_A2.1)
NetC13_Driver1_1: Motor1/Driver (C13_Driver1.1 D1_Driver1.41), Motor1/MOSFETs (PMOTOR1_MOSFETs1.2), Motor1/MOSFETs/Channel_B (Q1_Channel_B1.3 Q2_Channel_B1.1)
NetC13_Driver2_1: Motor2/Driver (C13_Driver2.1 D1_Driver2.41), Motor2/MOSFETs (PMOTOR1_MOSFETs2.2), Motor2/MOSFETs/Channel_B (Q1_Channel_B2.3 Q2_Channel_B2.1)
NetC14_Driver1_1: Motor1/Driver (C14_Driver1.1 D1_Driver1.36), Motor1/MOSFETs (PMOTOR1_MOSFETs1.3), Motor1/MOSFETs/Channel_C (Q1_Channel_C1.3 Q2_Channel_C1.1)
NetC14_Driver2_1: Motor2/Driver (C14_Driver2.1 D1_Driver2.36), Motor2/MOSFETs (PMOTOR1_MOSFETs2.3), Motor2/MOSFETs/Channel_C (Q1_Channel_C2.3 Q2_Channel_C2.1)
NetC18_Driver1_2: Main (D3.9), Motor1/Driver (C18_Driver1.2 R15_Driver1.2)
NetC18_Driver2_2: Main (D3.17), Motor2/Driver (C18_Driver2.2 R15_Driver2.2)
NetC19_Driver1_2: Main (D3.8), Motor1/Driver (C19_Driver1.2 R14_Driver1.2)
NetC19_Driver2_2: Main (D3.11), Motor2/Driver (C19_Driver2.2 R14_Driver2.2)
NetC27_2: Main (D3.22), Power (C27.2 D4.1)
NetD1_Driver1_5: Main (D3.5), Motor1/Driver (D1_Driver1.5 R8_Driver1.1)
NetD1_Driver1_6: Main (D3.6), Motor1/Driver (D1_Driver1.6 R7_Driver1.1)
NetD1_Driver1_8: Main (D3.54), Motor1/Driver (D1_Driver1.8)
NetD1_Driver1_9: Main (D3.57), Motor1/Driver (D1_Driver1.9), Motor2/Driver (D1_Driver2.9)
NetD1_Driver1_10: Main (D3.56), Motor1/Driver (D1_Driver1.10), Motor2/Driver (D1_Driver2.10)
NetD1_Driver1_11: Main (D3.55), Motor1/Driver (D1_Driver1.11), Motor2/Driver (D1_Driver2.11)
NetD1_Driver1_12: Main (D3.62), Motor1/Driver (D1_Driver1.12)
NetD1_Driver1_16: Main (D3.4), Motor1/Driver (D1_Driver1.16)
NetD1_Driver1_17: Main (D3.41), Motor1/Driver (D1_Driver1.17)
NetD1_Driver1_18: Main (D3.34), Motor1/Driver (D1_Driver1.18)
NetD1_Driver1_19: Main (D3.42), Motor1/Driver (D1_Driver1.19)
NetD1_Driver1_20: Main (D3.35), Motor1/Driver (D1_Driver1.20)
NetD1_Driver1_21: Main (D3.43), Motor1/Driver (D1_Driver1.21)
NetD1_Driver1_22: Main (D3.36), Motor1/Driver (D1_Driver1.22)
NetD1_Driver1_35: Motor1/Driver (D1_Driver1.35), Motor1/MOSFETs/Channel_C (R2_Channel_C1.1)
NetD1_Driver1_37: Motor1/Driver (D1_Driver1.37), Motor1/MOSFETs/Channel_C (R1_Channel_C1.1)
NetD1_Driver1_40: Motor1/Driver (D1_Driver1.40), Motor1/MOSFETs/Channel_B (R2_Channel_B1.1)
NetD1_Driver1_42: Motor1/Driver (D1_Driver1.42), Motor1/MOSFETs/Channel_B (R1_Channel_B1.1)
NetD1_Driver2_5: Main (D3.30), Motor2/Driver (D1_Driver2.5 R8_Driver2.1)
NetD1_Driver2_6: Main (D3.29), Motor2/Driver (D1_Driver2.6 R7_Driver2.1)
NetD1_Driver2_8: Main (D3.53), Motor2/Driver (D1_Driver2.8)
NetD1_Driver2_12: Main (D3.50), Motor2/Driver (D1_Driver2.12)
NetD1_Driver2_16: Main (D3.28), Motor2/Driver (D1_Driver2.16)
NetD1_Driver2_17: Main (D3.37), Motor2/Driver (D1_Driver2.17)
NetD1_Driver2_18: Main (D3.23), Motor2/Driver (D1_Driver2.18)
NetD1_Driver2_19: Main (D3.38), Motor2/Driver (D1_Driver2.19)
NetD1_Driver2_20: Main (D3.26), Motor2/Driver (D1_Driver2.20)
NetD1_Driver2_21: Main (D3.39), Motor2/Driver (D1_Driver2.21)
NetD1_Driver2_22: Main (D3.27), Motor2/Driver (D1_Driver2.22)
NetD1_Driver2_35: Motor2/Driver (D1_Driver2.35), Motor2/MOSFETs/Channel_C (R2_Channel_C2.1)
NetD1_Driver2_37: Motor2/Driver (D1_Driver2.37), Motor2/MOSFETs/Channel_C (R1_Channel_C2.1)
NetD1_Driver2_40: Motor2/Driver (D1_Driver2.40), Motor2/MOSFETs/Channel_B (R2_Channel_B2.1)
NetD1_Driver2_42: Motor2/Driver (D1_Driver2.42), Motor2/MOSFETs/Channel_B (R1_Channel_B2.1)
NetD3_2: Main (D3.2), Provisions (R38.2)
NetD3_3: Main (D3.3), Provisions (R37.2)
NetD3_10: Main (D3.10), OPs (R25.2 U1.1)
NetD3_24: Main (D3.24), OPs (R33.2 U1.8)
NetD3_25: Main (D3.25), OPs (R26.2 U1.7)
NetD3_33: Main (D3.33), Provisions (S1.8)
NetD3_40: Main (D3.40), Provisions (S1.7)
NetD3_44: Main (D3.44), Provisions (S1.6)
NetD3_45: Main (D3.45), Provisions (S1.5)
NetD3_46: Main (D3.46), Provisions (PSWIM1.4)
NetD3_49: Main (D3.49), Provisions (PSWIM1.1)
NetD3_60: Main (D3.60), Provisions (R39.1)
~{RST}: Main (D3.7), Provisions (R36.1)
SN1_Motor1: Motor1/Driver (R13_Driver1.1), Motor1/MOSFETs/Channel_A (C2_Channel_A1.2 Q2_Channel_A1.3 R3_Channel_A1.2 R4_Channel_A1.2)
SN1_Motor2: Motor2/Driver (R13_Driver2.1), Motor2/MOSFETs/Channel_A (C2_Channel_A2.2 Q2_Channel_A2.3 R3_Channel_A2.2 R4_Channel_A2.2)
SN2_Motor1: Motor1/Driver (D1_Driver1.39 R17_Driver1.1), Motor1/MOSFETs/Channel_B (C2_Channel_B1.2 Q2_Channel_B1.3 R3_Channel_B1.2 R4_Channel_B1.2)
SN2_Motor2: Motor2/Driver (D1_Driver2.39 R17_Driver2.1), Motor2/MOSFETs/Channel_B (C2_Channel_B2.2 Q2_Channel_B2.3 R3_Channel_B2.2 R4_Channel_B2.2)
SN3: Motor1/Driver (D1_Driver1.34), Motor1/MOSFETs/Channel_C (C2_Channel_C1.2 Q2_Channel_C1.3 R3_Channel_C1.2 R4_Channel_C1.2), OPs (U1.3)
SN3: Motor2/Driver (D1_Driver2.34), Motor2/MOSFETs/Channel_C (C2_Channel_C2.2 Q2_Channel_C2.3 R3_Channel_C2.2 R4_Channel_C2.2), OPs (U1.10)